# EAGLE design pixelAdapter_l432 pro (EAGLE 9.6.2)
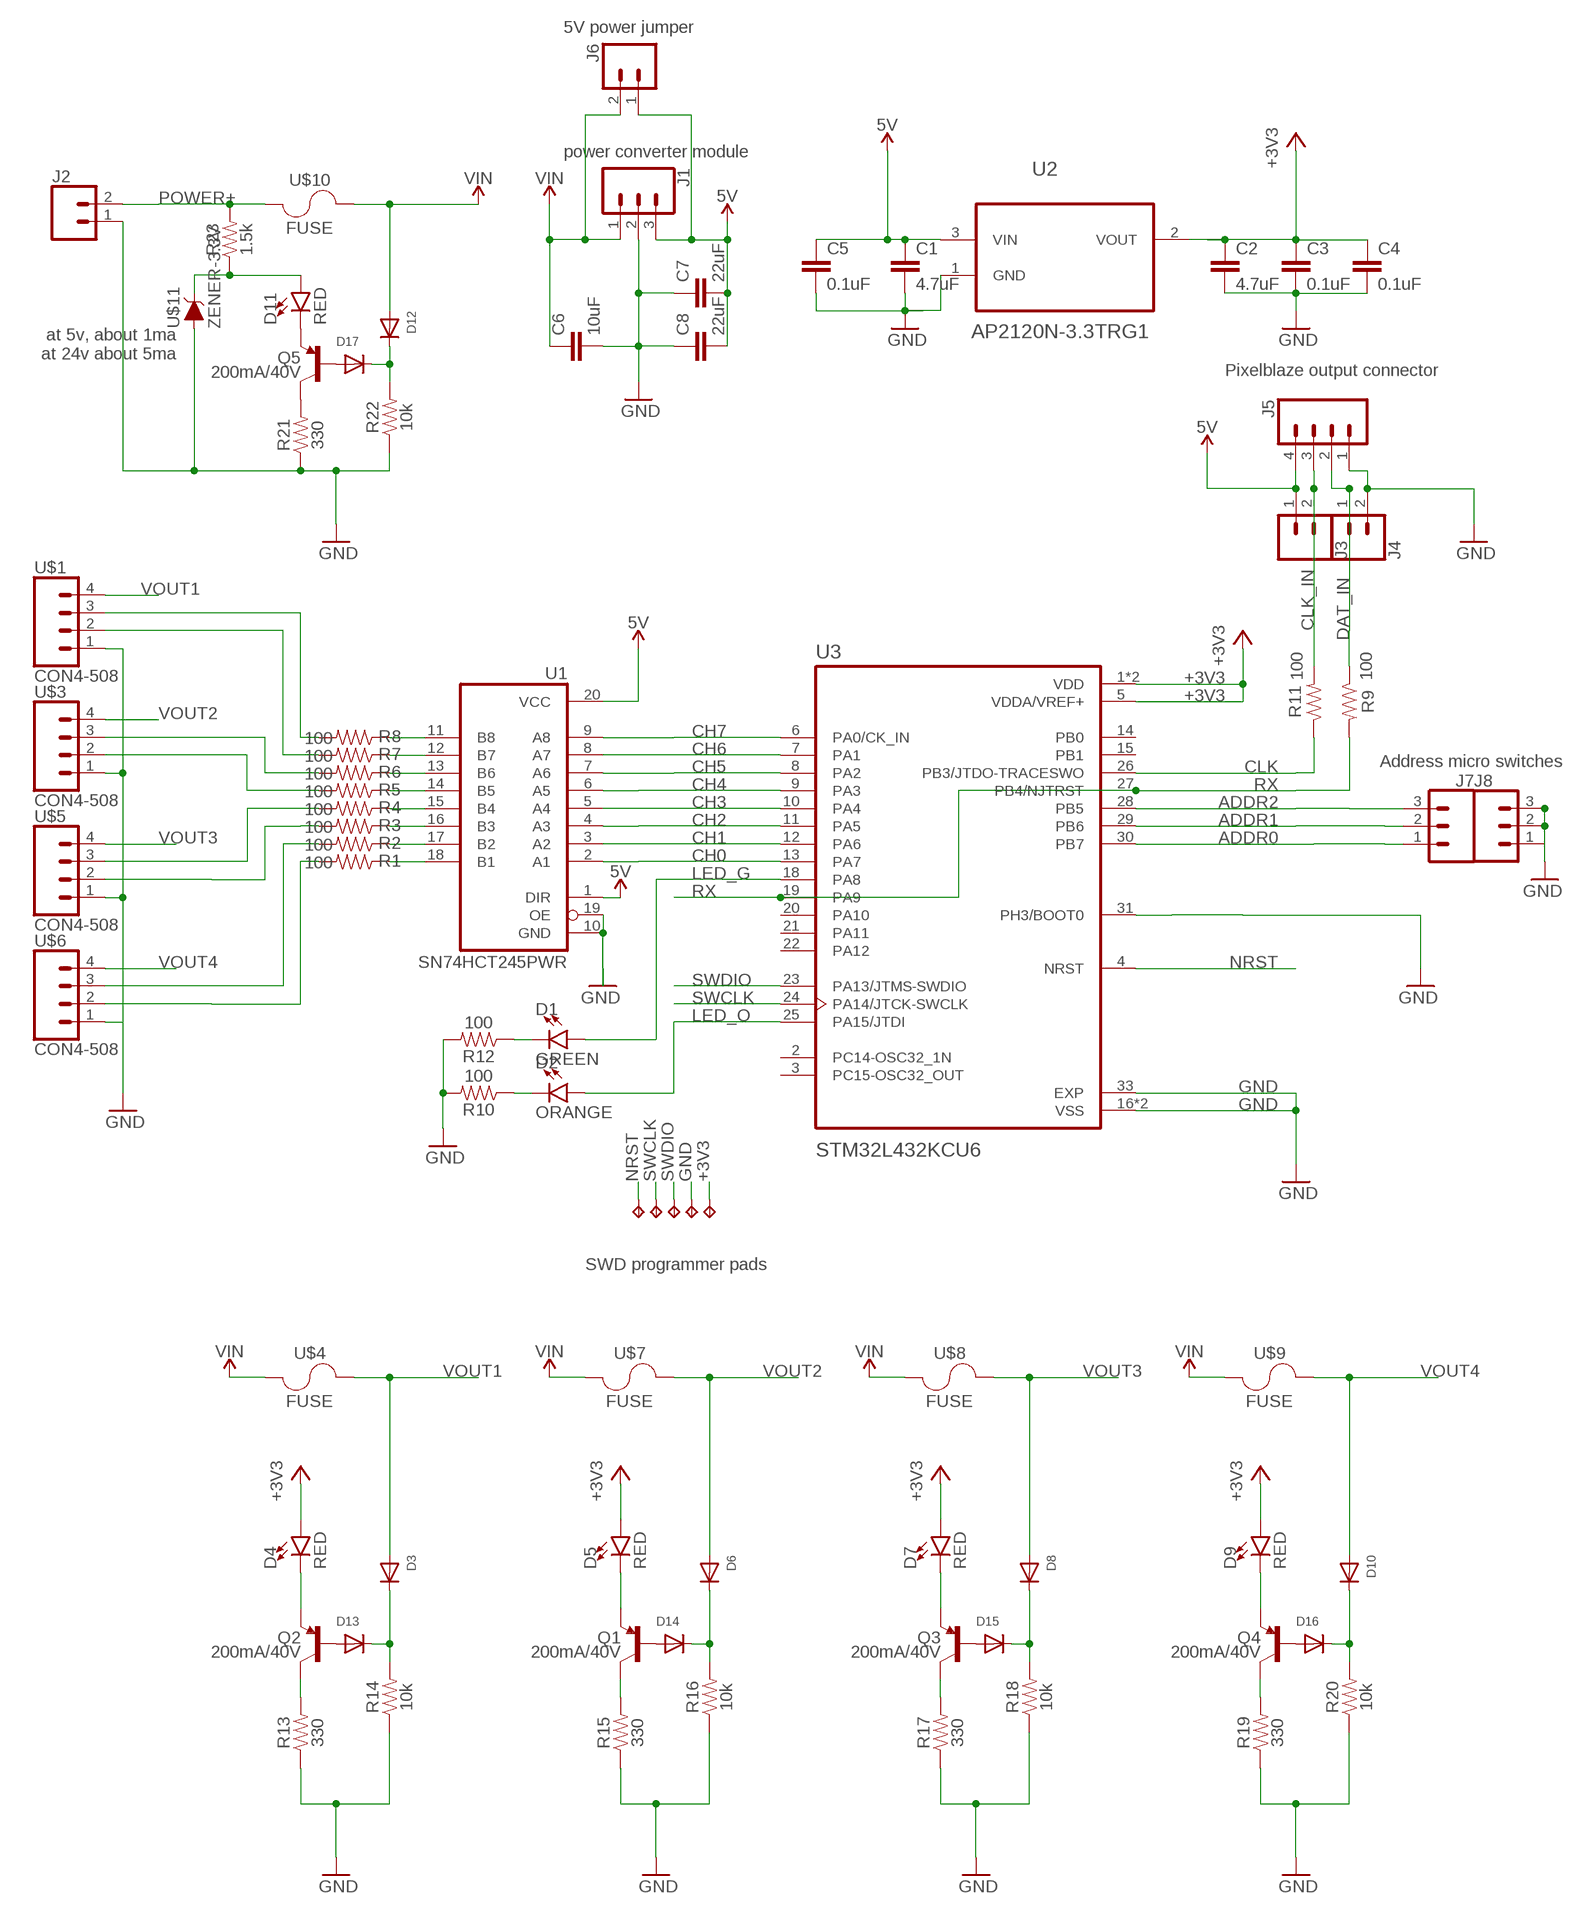
[diagram p0: schematic, sheet 1]

## Parts
C1  4.7uF  4.7UF0603  [0603]
C2  4.7uF  4.7UF0603  [0603]
C3  0.1uF  0.1UF-0603-25V-(+80/-20%)  [0603]
C4  0.1uF  0.1UF-0603-25V-(+80/-20%)  [0603]
C5  0.1uF  0.1UF-0603-25V-(+80/-20%)  [0603]
C6  10uF  10UF-1210-50V-20%  [1210]
C7  22uF  22UF-1210-16V-20%  [1210]
C8  22uF  22UF-1210-16V-20%  [1210]
D1  GREEN  LED0603  [LED-0603]
D2  ORANGE  LED0603  [LED-0603]
D3  DIODESOD-123  [SOD-123]
D4  RED  LED-RED0603  [LED-0603]
D5  RED  LED-RED0603  [LED-0603]
D6  DIODESOD-123  [SOD-123]
D7  RED  LED-RED0603  [LED-0603]
D8  DIODESOD-123  [SOD-123]
D9  RED  LED-RED0603  [LED-0603]
D10  DIODESOD-123  [SOD-123]
D11  RED  LED-RED0603  [LED-0603]
D12  DIODESOD-123  [SOD-123]
D13  DIODESOD-123  [SOD-123]
D14  DIODESOD-123  [SOD-123]
D15  DIODESOD-123  [SOD-123]
D16  DIODESOD-123  [SOD-123]
D17  DIODESOD-123  [SOD-123]
J1  CONN_03  [1X03]
J2  CONN_025MM  [SCREWTERMINAL-5MM-2]
J3  CONN_025MM  [SCREWTERMINAL-5MM-2]
J4  CONN_025MM  [SCREWTERMINAL-5MM-2]
J5  CONN_04LOCK  [1X04_LOCK]
J6  CONN_02  [1X02]
J7  CONN_03LOCK  [1X03_LOCK]
J8  CONN_03LOCK  [1X03_LOCK]
Q1  200mA/40V  TRANS_PNP-PMBT3906|MMBT3906L  [SOT23-3]
Q2  200mA/40V  TRANS_PNP-PMBT3906|MMBT3906L  [SOT23-3]
Q3  200mA/40V  TRANS_PNP-PMBT3906|MMBT3906L  [SOT23-3]
Q4  200mA/40V  TRANS_PNP-PMBT3906|MMBT3906L  [SOT23-3]
Q5  200mA/40V  TRANS_PNP-PMBT3906|MMBT3906L  [SOT23-3]
R1  100  100OHM-0603-1/10W-1%  [0603]
R2  100  100OHM-0603-1/10W-1%  [0603]
R3  100  100OHM-0603-1/10W-1%  [0603]
R4  100  100OHM-0603-1/10W-1%  [0603]
R5  100  100OHM-0603-1/10W-1%  [0603]
R6  100  100OHM-0603-1/10W-1%  [0603]
R7  100  100OHM-0603-1/10W-1%  [0603]
R8  100  100OHM-0603-1/10W-1%  [0603]
R9  100  100OHM-0603-1/10W-1%  [0603]
R10  100  100OHM-0603-1/10W-1%  [0603]
R11  100  100OHM-0603-1/10W-1%  [0603]
R12  100  100OHM-0603-1/10W-1%  [0603]
R13  330  RESISTOR0603  [0603]
R14  10k  10KOHM-0603-1/10W-1%  [0603]
R15  330  RESISTOR0603  [0603]
R16  10k  10KOHM-0603-1/10W-1%  [0603]
R17  330  RESISTOR0603  [0603]
R18  10k  10KOHM-0603-1/10W-1%  [0603]
R19  330  RESISTOR0603  [0603]
R20  10k  10KOHM-0603-1/10W-1%  [0603]
R21  330  RESISTOR0603  [0603]
R22  10k  10KOHM-0603-1/10W-1%  [0603]
R23  1.5k  1.5KOHM-0603-1/10W-1%  [0603]
TP1  TPTP20SQ  [TP20SQ]
TP2  TPTP20SQ  [TP20SQ]
TP3  TPTP20SQ  [TP20SQ]
TP4  TPTP20SQ  [TP20SQ]
TP5  TPTP20SQ  [TP20SQ]
U1  SN74HCT245PWR  74245PW  [TSSOP20]
U2  AP2120N-3.3TRG1  MCP1700T-3302E/TT  [SOT95P237X112-3N]
U3  STM32L432KCU6  [QFN50P500X500X60-33N]
U$1  CON4-508  [CON4-508]
U$3  CON4-508  [CON4-508]
U$4  FUSE  [KEYSTONE-3586-FUSEHOLDER]
U$5  CON4-508  [CON4-508]
U$6  CON4-508  [CON4-508]
U$7  FUSE  [KEYSTONE-3586-FUSEHOLDER]
U$8  FUSE  [KEYSTONE-3586-FUSEHOLDER]
U$9  FUSE  [KEYSTONE-3586-FUSEHOLDER]
U$10  FUSE  [KEYSTONE-3586-FUSEHOLDER]
U$11  ZENER-3.3V  ZENER  [SOD-123FL]

## Nets
5V: C1.1 C5.1 C7.2 C8.2 J1.3 J3.1 J5.4 J6.1 U1.1(DIR) U1.20(VCC) U2.3(VIN)
+3V3: C2.1 C3.1 C4.1 D4.A D5.A D7.A D9.A TP4.TP U2.2(VOUT) U3.1(VDD) U3.5(VDDA/VREF+) U3.17(VDD)
ADDR0: J7.1 U3.30(PB7)
ADDR1: J7.2 U3.29(PB6)
ADDR2: J7.3 U3.28(PB5)
CH0: U1.2(A1) U3.13(PA7)
CH1: U1.3(A2) U3.12(PA6)
CH2: U1.4(A3) U3.11(PA5)
CH3: U1.5(A4) U3.10(PA4)
CH4: U1.6(A5) U3.9(PA3)
CH5: U1.7(A6) U3.8(PA2)
CH6: U1.8(A7) U3.7(PA1)
CH7: U1.9(A8) U3.6(PA0/CK_IN)
CLK: R11.1 U3.26(PB3/JTDO-TRACESWO)
CLK_IN: J3.2 J5.3 R11.2
DAT_IN: J4.1 J5.2 R9.1
GND: C1.2 C2.2 C3.2 C4.2 C5.2 C6.2 C7.1 C8.1 J1.2 J2.1 J4.2 J5.1 J8.1 J8.2 J8.3 R10.2 R12.2 R13.1 R14.1 R15.1 R16.1 R17.1 R18.1 R19.1 R20.1 R21.1 R22.1 TP3.TP U1.10(GND) U1.19(OE) U2.1(GND) U3.16(VSS) U3.31(PH3/BOOT0) U3.32(VSS) U3.33(EXP) U$1.1 U$3.1 U$5.1 U$6.1 U$11.A
LED0: R1.2 U$6.2
LED1: R2.2 U$6.3
LED2: R3.2 U$5.2
LED3: R4.2 U$5.3
LED4: R5.2 U$3.2
LED5: R6.2 U$3.3
LED6: R7.2 U$1.2
LED7: R8.2 U$1.3
LED_G: D1.A U3.18(PA8)
LED_O: D2.A U3.25(PA15/JTDI)
N$1: D17.A Q5.1(B)
N$2: D1.C R12.1
N$3: D12.C D17.C R22.2
N$4: D3.C D13.C R14.2
N$5: D4.C Q2.2(E)
N$6: D11.C Q5.2(E)
N$7: Q2.3(C) R13.2
N$8: Q5.3(C) R21.2
N$9: D6.C D14.C R16.2
N$10: D5.C Q1.2(E)
N$11: Q1.3(C) R15.2
N$12: R1.1 U1.18(B1)
N$13: R2.1 U1.17(B2)
N$14: R3.1 U1.16(B3)
N$15: R4.1 U1.15(B4)
N$16: R5.1 U1.14(B5)
N$17: R6.1 U1.13(B6)
N$18: R7.1 U1.12(B7)
N$19: R8.1 U1.11(B8)
N$20: D11.A R23.1 U$11.C
N$21: D2.C R10.1
N$22: D8.C D15.C R18.2
N$23: D7.C Q3.2(E)
N$24: Q3.3(C) R17.2
N$25: D13.A Q2.1(B)
N$26: D10.C D16.C R20.2
N$27: D9.C Q4.2(E)
N$28: Q4.3(C) R19.2
N$29: D14.A Q1.1(B)
N$30: D15.A Q3.1(B)
N$31: D16.A Q4.1(B)
NRST: TP5.TP U3.4(NRST)
POWER+: J2.2 R23.2 U$10.A1 U$10.A2 U$10.A3
RX: R9.2 U3.19(PA9) U3.27(PB4/NJTRST)
SWCLK: TP1.TP U3.24(PA14/JTCK-SWCLK)
SWDIO: TP2.TP U3.23(PA13/JTMS-SWDIO)
VIN: C6.1 D12.A J1.1 J6.2 U$4.A1 U$4.A2 U$4.A3 U$7.A1 U$7.A2 U$7.A3 U$8.A1 U$8.A2 U$8.A3 U$9.A1 U$9.A2 U$9.A3 U$10.B1 U$10.B2 U$10.B3
VOUT1: D3.A U$1.4 U$4.B1 U$4.B2 U$4.B3
VOUT2: D6.A U$3.4 U$7.B1 U$7.B2 U$7.B3
VOUT3: D8.A U$5.4 U$8.B1 U$8.B2 U$8.B3
VOUT4: D10.A U$6.4 U$9.B1 U$9.B2 U$9.B3
Unconnected: U3.2(PC14-OSC32_1N) U3.3(PC15-OSC32_OUT) U3.14(PB0) U3.15(PB1) U3.20(PA10) U3.21(PA11) U3.22(PA12)

## Notes on the sheet
- 5V power jumper
- power converter module
- at 5v, about 1ma
  at 24v about 5ma
- Pixelblaze output connector
- Address micro switches
- SWD programmer pads

## Library data of the parts
C1 C2 = SparkFun-Capacitors:4.7UF: 4.7µF ceramic capacitors A capacitor is a passive two-terminal electrical component used to store electrical energy temporarily in an electric field.; PROD_ID: CAP-08280
C3-C5 = SparkFun-Capacitors:0.1UF: 0.1µF ceramic capacitors A capacitor is a passive two-terminal electrical component used to store electrical energy temporarily in an electric field.; PROD_ID: CAP-00810
C6 = SparkFun-Capacitors:10UF: 10.0µF ceramic capacitors A capacitor is a passive two-terminal electrical component used to store electrical energy temporarily in an electric field.; PROD_ID: CAP-09824
C7 C8 = SparkFun-Capacitors:22UF: 22µF ceramic capacitors A capacitor is a passive two-terminal electrical component used to store electrical energy temporarily in an electric field.
D1 D2 = SparkFun-LED:LED: LED (Generic) Standard schematic elements and footprints for 5mm, 3mm, 1206, and 0603 sized LEDs. Generic LEDs with no color specified.
D3 D6 D8 D10 D12-D17 = adafruit:DIODE: Diode SMADIODE - SMA Surface Mount Package 20V 1A Schottky Diode Digikey: 641-1014-6-ND DO-1N4148 - Through Hole Small Current Diode SOD-123 20V 1 A (.5mV Vf) Schottky Diode - Digikey: MBRX120TPMSCT-ND SOD-323 10V 570mA (.38mV Vf, 3ns) Schottky Diode - Digikey: ZLLS410CT-ND SOD-523 30V 30mA Schottky Diode (RB751S-40TE61) - Digikey: RB751S-40TE61CT-ND SOT23-R/W - SOT23 Package (R = Solder Paste/Reflow Ovens, W = Hand-Soldering) BAT54Film 40V 300mA - Digikey: 497-7162-1-ND
D4 D5 D7 D9 D11 = SparkFun-LED:LED-RED: Red SMD LED Used in manufacturing of most products at SparkFun Packages: 0603 - SMD 0603 package [Product Link] <http://docs.avagotech.com/docs/AV02-0551EN> 0603 SMART - SMD 0603 SMART package ( more efficient and expensive)[Product Link] <http://www.osram-os.com/Graphics/XPic2/00077099_0.pdf> 1206 - SMD1206 package [Product Link] <https://www.sparkfun.com/datasheets/DevTools/LilyPad/Q150OVS4.pdff> SparkFun Products: Pro Mini 328 -5V <https://www.sparkfun.com/products/821> RedBoard <https://www.sparkfun.com/products/12757> IOIO-OTG <https://www.sparkfun.com/products/13613>; PROD_ID: DIO-00819
J1 J7 J8 = SparkFun-Connectors:CONN_03: Multi connection point. Often used as Generic Header-pin footprint for 0.1 inch spaced/style header connections On any of the 0.1 inch spaced packages, you can populate with these: Break Away Headers - Straight <https://www.sparkfun.com/products/116> (PRT-00116) Break Away Male Headers - Right Angle <https://www.sparkfun.com/products/553> (PRT-00553) Female Headers <https://www.sparkfun.com/products/115> (PRT-00115) Break Away Headers - Machine Pin <https://www.sparkfun.com/products/117> (PRT-00117) Break Away Female Headers - Swiss Machine Pin <https://www.sparkfun.com/products/743> (PRT-00743) Stackable Header - 3 Pin (Female, 0.1") <https://www.sparkfun.com/products/13875> (PRT-13875) For SCREWTERMINALS and SPRING TERMINALS visit here: Screw Terimnals on SparkFun.com <https://www.sparkfun.com/search/results?term=Screw+Terminals> (5mm/3.5mm/2.54mm spacing) This device is also useful as a general connection point to wire up your design to another part of your project. Our various solder wires solder well into these plated through hole pads. Hook-Up Wire - Assortment (Stranded, 22 AWG) <https://www.sparkfun.com/products/11375> (PRT-11375) Hook-Up Wire - Assortment (Solid Core, 22 AWG) <https://www.sparkfun.com/products/11367> (PRT-11367) View the entire wire category on our website here <https://www.sparkfun.com/categories/141> Special notes: Molex polarized connector foot print use with SKU : PRT-08232 with associated crimp pins and housings.
J2-J4 = bens:CONN_02: Multi connection point. Often used as Generic Header-pin footprint for 0.1 inch spaced/style header connections On any of the 0.1 inch spaced packages, you can populate with these: Break Away Headers - Straight <https://www.sparkfun.com/products/116> (PRT-00116) Break Away Male Headers - Right Angle <https://www.sparkfun.com/products/553> (PRT-00553) Female Headers <https://www.sparkfun.com/products/115> (PRT-00115) Break Away Headers - Machine Pin <https://www.sparkfun.com/products/117> (PRT-00117) Break Away Female Headers - Swiss Machine Pin <https://www.sparkfun.com/products/743> (PRT-00743) For SCREWTERMINALS and SPRING TERMINALS visit here: Screw Terimnals on SparkFun.com <https://www.sparkfun.com/search/results?term=Screw+Terminals> (5mm/3.5mm/2.54mm spacing) This device is also useful as a general connection point to wire up your design to another part of your project. Our various solder wires solder well into these plated through hole pads. Hook-Up Wire - Assortment (Stranded, 22 AWG) <https://www.sparkfun.com/products/11375> (PRT-11375) Hook-Up Wire - Assortment (Solid Core, 22 AWG) <https://www.sparkfun.com/products/11367> (PRT-11367) View the entire wire category on our website here <https://www.sparkfun.com/categories/141> Special notes: Molex polarized connector foot print use with: PRT-08233 with associated crimp pins and housings. 2.54_SCREWTERM for use with PRT-10571. 3.5mm Screw Terminal footprints for PRT-08084 5mm Screw Terminal footprints for use with PRT-08432; SF_SKU: PRT-08432
J5 = SparkFun-Connectors:CONN_04: Multi connection point. Often used as Generic Header-pin footprint for 0.1 inch spaced/style header connections On any of the 0.1 inch spaced packages, you can populate with these: Break Away Headers - Straight <https://www.sparkfun.com/products/116> (PRT-00116) Break Away Male Headers - Right Angle <https://www.sparkfun.com/products/553> (PRT-00553) Female Headers <https://www.sparkfun.com/products/115> (PRT-00115) Break Away Headers - Machine Pin <https://www.sparkfun.com/products/117> (PRT-00117) Break Away Female Headers - Swiss Machine Pin <https://www.sparkfun.com/products/743> (PRT-00743) For SCREWTERMINALS and SPRING TERMINALS visit here: Screw Terimnals on SparkFun.com <https://www.sparkfun.com/search/results?term=Screw+Terminals> (5mm/3.5mm/2.54mm spacing) This device is also useful as a general connection point to wire up your design to another part of your project. Our various solder wires solder well into these plated through hole pads. Hook-Up Wire - Assortment (Stranded, 22 AWG) <https://www.sparkfun.com/products/11375> (PRT-11375) Hook-Up Wire - Assortment (Solid Core, 22 AWG) <https://www.sparkfun.com/products/11367> (PRT-11367) View the entire wire category on our website here <https://www.sparkfun.com/categories/141> Special notes: Molex polarized connector foot print use with SKU : PRT-08231 with associated crimp pins and housings. 1MM SMD Version SKU: PRT-10208; PROD_ID: CONN-09696
J6 = SparkFun-Connectors:CONN_02: Multi connection point. Often used as Generic Header-pin footprint for 0.1 inch spaced/style header connections On any of the 0.1 inch spaced packages, you can populate with these: Break Away Headers - Straight <https://www.sparkfun.com/products/116> (PRT-00116) Break Away Male Headers - Right Angle <https://www.sparkfun.com/products/553> (PRT-00553) Female Headers <https://www.sparkfun.com/products/115> (PRT-00115) Break Away Headers - Machine Pin <https://www.sparkfun.com/products/117> (PRT-00117) Break Away Female Headers - Swiss Machine Pin <https://www.sparkfun.com/products/743> (PRT-00743) For SCREWTERMINALS and SPRING TERMINALS visit here: Screw Terimnals on SparkFun.com <https://www.sparkfun.com/search/results?term=Screw+Terminals> (5mm/3.5mm/2.54mm spacing) This device is also useful as a general connection point to wire up your design to another part of your project. Our various solder wires solder well into these plated through hole pads. Hook-Up Wire - Assortment (Stranded, 22 AWG) <https://www.sparkfun.com/products/11375> (PRT-11375) Hook-Up Wire - Assortment (Solid Core, 22 AWG) <https://www.sparkfun.com/products/11367> (PRT-11367) View the entire wire category on our website here <https://www.sparkfun.com/categories/141> Special notes: Molex polarized connector foot print use with: PRT-08233 with associated crimp pins and housings. 2.54_SCREWTERM for use with PRT-10571. 3.5mm Screw Terminal footprints for PRT-08084 5mm Screw Terminal footprints for use with PRT-08432
Q1-Q5 = SparkFun-DiscreteSemi:TRANS_PNP: PNP transistor Current controlled devices typically used to amplify current or used as a switch. SparkFun Products: SparkFun Serial Enabled 16x2 LCD - Red on Black <https://www.sparkfun.com/products/9068> SparkFun Logomatic <https://www.sparkfun.com/products/12772>; PROD_ID: TRANS-08052
R1-R12 = SparkFun-Resistors:100OHM: 100Ω resistor A resistor is a passive two-terminal electrical component that implements electrical resistance as a circuit element. Resistors act to reduce current flow, and, at the same time, act to lower voltage levels within circuits. - Wikipedia; PROD_ID: RES-07863
R13 R15 R17 R19 R21 = SparkFun-Resistors:RESISTOR: Generic Resistor Package
R14 R16 R18 R20 R22 = SparkFun-Resistors:10KOHM: 10kΩ resistor A resistor is a passive two-terminal electrical component that implements electrical resistance as a circuit element. Resistors act to reduce current flow, and, at the same time, act to lower voltage levels within circuits. - Wikipedia; PROD_ID: RES-00824
R23 = SparkFun-Resistors:1.5KOHM: 1.5kΩ resistor A resistor is a passive two-terminal electrical component that implements electrical resistance as a circuit element. Resistors act to reduce current flow, and, at the same time, act to lower voltage levels within circuits. - Wikipedia; PROD_ID: RES-08306
TP1-TP5 = testpad:TP: Test pad
U1 = scanlime:74*245: Octal BUS TRANSCEIVER, 3-state
U2 = Microchip_By_element14_Batch_1:MCP1700T-3302E/TT: Low Quiescent Current LDO; MPN: MCP1700T-3302E/TT; OC_FARNELL: 1296592; OC_NEWARK: 88H9817; PACKAGE: SOT23-3; SUPPLIER: Microchip
U3 = STM32L432KCU6:STM32L432KCU6: None Check prices <https://pricing.snapeda.com/parts/STM32L432KCU6/STMicroelectronics/view-part?ref=eda>; AVAILABILITY: Good; DESCRIPTION: ARM® Cortex®-M4 STM32L4 Microcontroller IC 32-Bit 80MHz 256KB (256K x 8) FLASH 32-UFQFPN (5x5); MF: STMicroelectronics; MP: STM32L432KCU6; PACKAGE: UFQFN-32 STMicroelectronics; PRICE: None; PURCHASE-URL: https://pricing.snapeda.com/search/part/STM32L432KCU6/?ref=eda
U$1 U$3 U$5 U$6 = bens:CON4-508
U$4 U$7-U$10 = bens:FUSE
U$11 = bens:ZENER

## Net classes
1 power: width 0.254 mm

## Board
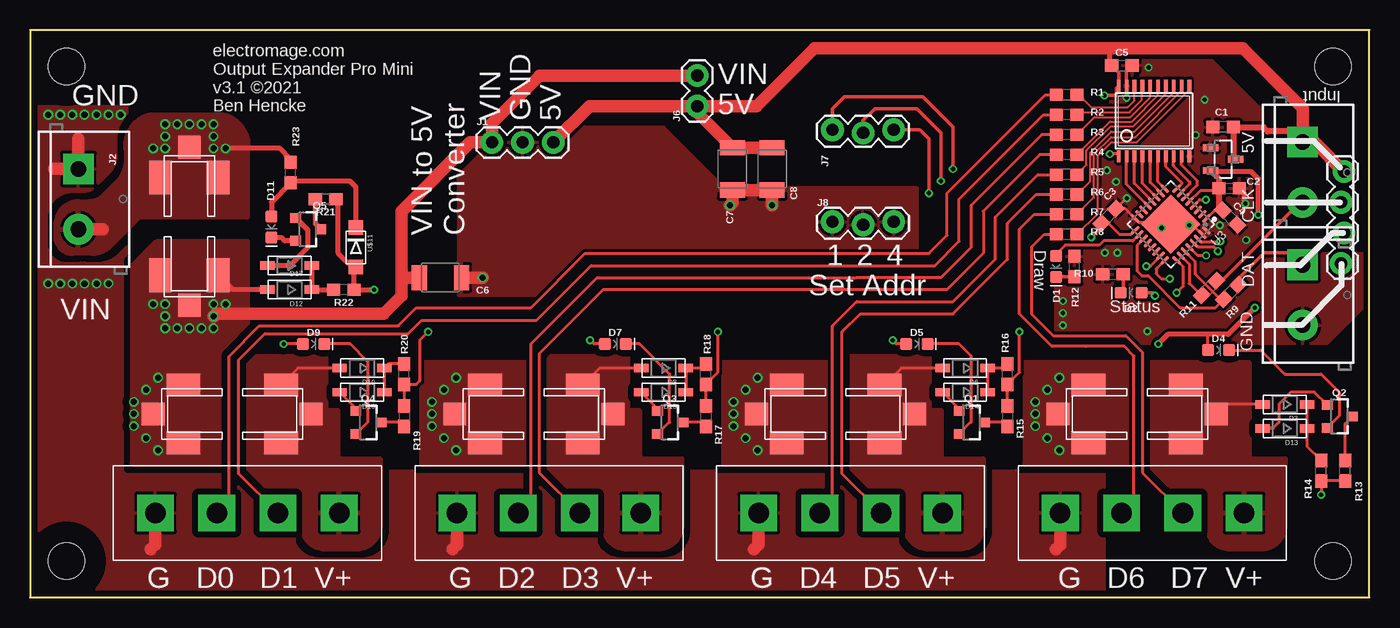
[diagram p1: board, top side]
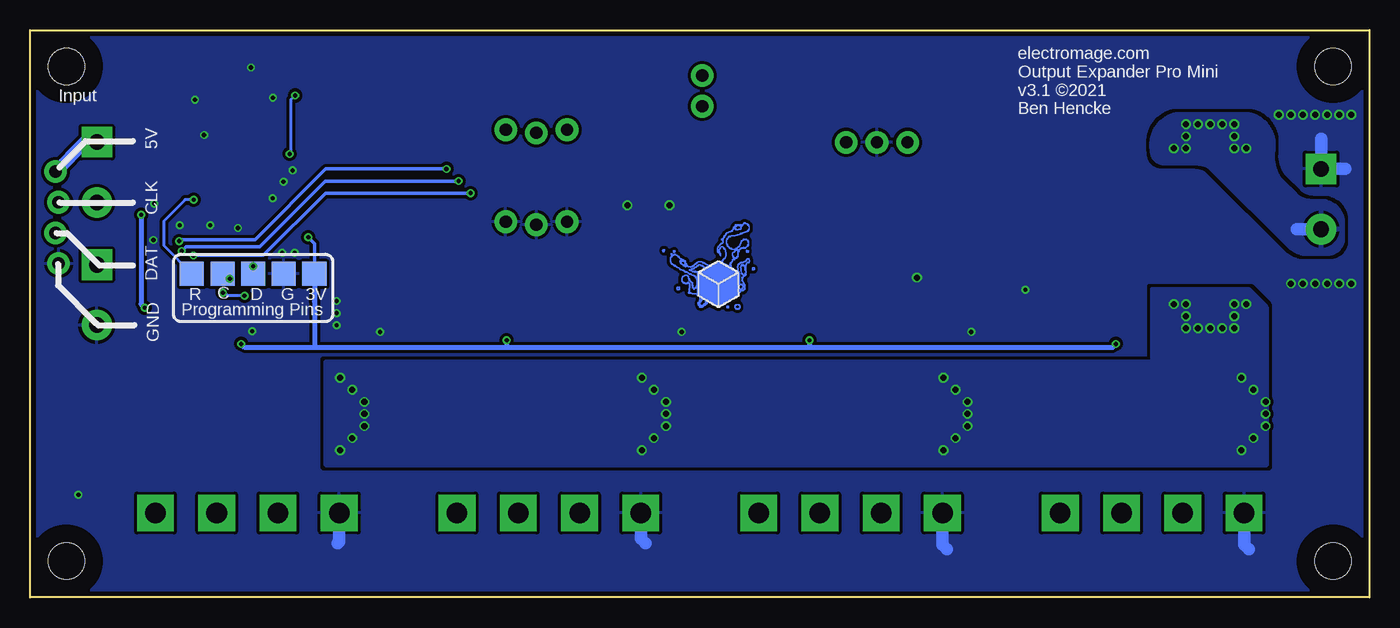
[diagram p2: board, bottom side, seen from below]

Size 111 x 47 mm. Coordinates in mm from the lower left corner, seen from the top.
Outline: 0,0 111,0 111,47 0,47 0,0
Copper layers (1*16): Top 0.035mm / dielectric 1.5mm / Bottom 0.035mm
Design rules "jlcpcb_2_layer *": minimum track width 6mil, minimum drill 0.35mm, track to track 6mil, track to pad 6mil, pad to pad 6mil, via to via 6mil, smd to smd 6mil, copper to edge 0.4mm, drill to drill 6mil, minimum pad ring 6mil, minimum via ring 6mil, stop-mask expansion 1mil, vias tented up to drill 25mil, thermal gap 10mil
Holes 3 mm at 3,3 108,3 3,44 108,44
tRestrict: area 0.3,0.3 to 5.7,5.7; area 0.3,41.3 to 5.7,46.7
bRestrict: area 0.3,0.3 to 5.7,5.7; area 0.3,41.3 to 5.7,46.7; area 105.3,41.3 to 110.7,46.7; area 105.3,0.3 to 110.7,5.7

### Footprints (pad centres in the part's own frame; a part is rotated, then mirrored left to right if it is on the bottom)
0603 = smd 1.1 x 1: 1 -0.85,0; 2 0.85,0
1210 = smd 1.27 x 2.06: 1 -1.755,0; 2 1.755,0
LED-0603 = smd 1 x 1: A -0.877,0; C 0.877,0
SOD-123 = smd 1.2 x 0.7: A 1.85,0; C -1.85,0
1X03 = drill 1.016 pad 1.88: 1 0,0; 2 2.54,0; 3 5.08,0
SCREWTERMINAL-5MM-2 = drill 1.3 pad 2.54 square: 1 0,0 | drill 1.3 pad 2.54: 2 5,0
1X04_LOCK = drill 1.016 pad 1.88: 1 0,0.127; 2 2.54,-0.127; 3 5.08,0.127; 4 7.62,-0.127
1X02 = drill 1.016 pad 1.88: 1 0,0; 2 2.54,0
1X03_LOCK = drill 1.016 pad 1.88: 1 0,0.127; 2 2.54,-0.127; 3 5.08,0.127
SOT23-3 = smd 0.8 x 0.9: 1 -0.95,-1; 2 0.95,-1; 3 0,1.1
TP20SQ = smd 2 x 2: TP 0,0
TSSOP20 = smd 0.305 x 0.991: 1 -2.925,-2.918; 2 -2.275,-2.918; 3 -1.625,-2.918; 4 -0.975,-2.918; 5 -0.325,-2.918; 6 0.325,-2.918; 7 0.975,-2.918; 8 1.625,-2.918; 9 2.275,-2.918; 10 2.925,-2.918; 11 2.925,2.918; 12 2.275,2.918; 13 1.625,2.918; 14 0.975,2.918; 15 0.325,2.918; 16 -0.325,2.918; 17 -0.975,2.918; 18 -1.625,2.918; 19 -2.275,2.918; 20 -2.925,2.918
SOT95P237X112-3N = smd 0.559 x 1.27: 1 -0.94,-1.041; 2 0.94,-1.041; 3 0,1.041
QFN50P500X500X60-33N = smd 0.86 x 0.25: 1 -2.435,1.75; 2 -2.435,1.25; 3 -2.435,0.75; 4 -2.435,0.25; 5 -2.435,-0.25; 6 -2.435,-0.75; 7 -2.435,-1.25; 8 -2.435,-1.75; 17 2.435,-1.75; 18 2.435,-1.25; 19 2.435,-0.75; 20 2.435,-0.25; 21 2.435,0.25; 22 2.435,0.75; 23 2.435,1.25; 24 2.435,1.75 | smd 0.25 x 0.86: 9 -1.75,-2.435; 10 -1.25,-2.435; 11 -0.75,-2.435; 12 -0.25,-2.435; 13 0.25,-2.435; 14 0.75,-2.435; 15 1.25,-2.435; 16 1.75,-2.435; 25 1.75,2.435; 26 1.25,2.435; 27 0.75,2.435; 28 0.25,2.435; 29 -0.25,2.435; 30 -0.75,2.435; 31 -1.25,2.435; 32 -1.75,2.435 | smd 3.45 x 3.45: 33 0,0
CON4-508 = drill 1.7 pad 3.048 square: 1 -7.62,0; 2 -2.54,0; 3 2.54,0; 4 7.62,0
KEYSTONE-3586-FUSEHOLDER = smd 2.8 x 1.9: A1 -3.8,2.6; A3 -3.8,-2.2; B1 4.3,2.6; B3 4.3,-2.2 | smd 1.9 x 1.9: A2 -6.3,0.2; B2 6.8,0.2
SOD-123FL = smd 1.2 x 1.2: A 1.637,0; C -1.637,0

### Placement (x,y rotation side)
C1  98.88,38.98 180 top
C2  99.38,33.9 0 top
C3  89.39,31.61 45 top
C4  99.45,31.48 315 top
C5  90.49,44.08 0 top
C6  34,26.5 0 top
C7  58.2,35.5 90 top
C8  61.5,35.5 90 top
D1  85.03,27.42 270 top
D2  91.25,25.24 180 top
D3  104,16 180 top
D4  98.5,20.5 0 top
D5  73.5,21 0 top
D6  77.5,19 180 top
D7  48.5,21 0 top
D8  52.5,19 180 top
D9  23.5,21 0 top
D10  27.5,19 180 top
D11  20,30.7 270 top
D12  21.5,25.5 180 top
D13  104,14 180 top
D14  77.5,17 180 top
D15  52.5,17 180 top
D16  27.5,17 180 top
D17  21.5,27.5 180 top
J1  38.28,37.7 0 top
J2  4,35.5 270 top
J3  105.47,37.72 270 top
J4  105.47,27.56 270 top
J5  108.77,27.66 90 top
J6  55.3,40.7 90 top
J7  66.5,38.62 0 top
J8  66.5,31 0 top
Q1  78,14.5 270 top
Q2  108.5,15 270 top
Q3  53,14.5 270 top
Q4  28,14.5 270 top
Q5  23,30.5 270 top
R1  85.91,41.64 180 top
R2  85.91,39.99 180 top
R3  85.91,38.34 180 top
R4  85.91,36.69 180 top
R5  85.91,35.04 180 top
R6  85.91,33.39 180 top
R7  85.91,31.74 180 top
R8  85.91,30.09 180 top
R9  99.53,25.31 225 top
R10  89.75,26.77 180 top
R11  97.72,25.64 45 top
R12  86.55,27.42 90 top
R13  109,10.5 90 top
R14  107,10.5 90 top
R15  81,15 270 top
R16  81,18.5 90 top
R17  56,15 270 top
R18  56,18.5 90 top
R19  31,15 270 top
R20  31,18.5 90 top
R21  24.5,33 180 top
R22  26,25.5 180 top
R23  21.6,35.2 90 top
TP1  95.06,26.81 90 bottom
TP2  92.52,26.81 90 bottom
TP3  89.98,26.81 90 bottom
TP4  87.44,26.81 90 bottom
TP5  97.6,26.81 270 bottom
U1  93.15,39.48 0 top
U2  98.88,36.31 270 top
U3  94.54,30.91 225 top
U$1  93,7 0 top
U$2  [ELECTRO_MAGE_PCB4_PIXEL_2#PNG]  54.77,27.5 0 bottom
U$3  68,7 0 top
U$4  91.5,15 0 top
U$5  43,7 0 top
U$6  18,7 0 top
U$7  66.5,15 0 top
U$8  41.5,15 0 top
U$9  16.5,15 0 top
U$10  13,31 270 top
U$11  27,29 270 top

### Tracks (layer width: path | path; a pad name or v marks a point on that pad's centre or on a via)
5V  (via drill 0.35)
  Top 0.254: U1.1 90.23,36.74 v89.5,36.74
  Top 0.305: v89.05,41.59 v89.06,41.6 90.03,41.6 90.03,42.2 U1.20 90.23,43.48 C5.1
  Top 0.406: C5.1 89.5,44.21 89.5,45.5
  Top 0.508: U2.3 99.73,36.5 C1.1 102.23,38.98 102.58,38.62 104.57,38.62 J3.1
  Top 1.016: J6.1 46.35,40.7 J1.3 | J6.1 60.2,40.7 65,45.5 89.5,45.5 100.5,45.5 105.47,40.53 J3.1 106.46,37.72 J5.4 | C7.2 58.16,37.3 | C7.2 C8.2 | C7.2 55.3,40.16 J6.1
  Bottom 0.254: v89.05,41.59 89.4,41.24 89.4,36.84 v89.5,36.74
  Bottom 1.016: J5.4 106.46,37.72 J3.1
+3V3  (via drill 0.35)
  Top 0.254: U3.5 96.97,33.69 98.32,33.69 C2.1 | U3.17 91.27,30.11 90.28,30.11 89.38,31.01 C3.1 | U3.1 98.19,32.08 C4.1 | D9.A v21,21 | D4.A 97.62,21.8 94.3,21.8 | D7.A 46.7,21 v46.4,21.3 | D5.A 71.8,21 v71.5,21.3
  Top 0.305: C3.1 88.79,30.68 v87.95,29.83
  Top 0.406: U2.2 97.94,35.27 101.23,35.27 101.8,34.7 v101.8,31.7 | v101.5,24 99.3,21.8 94.3,21.8 v93.5,21
  Top 0.508: U2.2 98.53,34.68 C2.1 98.57,33.85 98.57,32.36 C4.1
  Bottom 0.305: TP4.TP 87.44,29.32 v87.95,29.83
  Bottom 0.406: TP4.TP 87.44,24.5 87.44,20.7 | 46.4,20.7 21.3,20.7 v21,21 | 46.4,20.7 46.5,20.7 71,20.7 71.5,20.7 | 71.5,20.7 87.44,20.7 | 87.44,20.7 93.2,20.7 v93.5,21 | v46.4,21.3 46.4,20.7 | v71.5,21.3 71.5,20.7 | v101.5,24 101.8,24.3 v101.8,31.7
ADDR0  (via drill 0.35)
  Top 0.254: U3.30 97.09,29.42 98.54,29.42 v98.64,29.52
  Top 0.305: v76.5,35.5 76.5,39 74,41.5 67.5,41.5 66.5,40.5 J7.1
  Bottom 0.305: v98.64,29.52 98.51,29.65 92.35,29.65 86.5,35.5 v76.5,35.5
ADDR1  (via drill 0.35)
  Top 0.254: U3.29 96.78,29.02 98.11,29.02 v98.43,28.69
  Top 0.305: v75.5,34.5 75.5,38.5 73.5,40.5 70,40.5 69.04,39.54 J7.2
  Bottom 0.305: v98.43,28.69 98.06,29.07 91.97,29.07 86.54,34.5 v75.5,34.5
ADDR2  (via drill 0.35)
  Top 0.254: U3.28 96.76,28.33 v97.47,28.33
  Top 0.305: v74.5,33.5 74.5,38 73.75,38.75 J7.3
  Bottom 0.305: v97.47,28.33 91.67,28.33 86.51,33.5 v74.5,33.5
CH0
  Top 0.254: U1.2 90.88,34.22 U3.13
CH1
  Top 0.254: U3.12 91.5,34.3 91.5,36.54 U1.3
CH2
  Top 0.254: U3.11 92.19,34.32 92.19,36.55 U1.4
CH3
  Top 0.254: U3.10 92.83,34.39 U1.5
CH4
  Top 0.254: U3.9 93.48,34.44 U1.6
CH5
  Top 0.254: U3.8 95.49,34.33 94.13,35.69 U1.7
CH6
  Top 0.254: U3.7 96.12,34.26 96.12,34.42 94.77,35.77 U1.8
CH7
  Top 0.254: U3.6 96.76,34.19 96.76,34.51 95.41,35.86 95.41,36.55 U1.9
CLK
  Top 0.254: U3.26 96.07,27.61 96.07,26.02 97.06,25.04 R11.1
CLK_IN
  Top 0.305: J5.3 105.49,32.74 J3.2 105.27,32.72 98.79,26.24 R11.2
DAT_IN
  Top 0.305: J5.2 108.11,30.2 J4.1 104.47,28.56 102.28,28.56 100.13,26.41 R9.1
GND  (via drill 0.35, 0.5)
  Top 0.254: U1.19 v90.88,41.4 | U3.31 96.37,30.85 v96.07,30.85 | U3.33 94.35,31.1 91.87,31.1 U3.16 91.02,31.95 90.76,32.21 C3.2 90.87,33.08 v90.89,33.08 | R19.1 R20.1 32,17.65 32.3,17.95 32.3,21.3 v33,22 | R13.1 R14.1 v107,8.5 | R17.1 R18.1 57,18.65 v57,22 | R15.1 R16.1 82,18.65 v82,22
  Top 0.305: U1.19 90.88,43.62 C5.2
  Top 0.406: 26.85,27.21 R22.1 v28.5,25.5 | 26.85,27.21 U$11.A | R21.1 25.5,32.85 25.5,28.56 26.85,27.21 | C2.2 100.61,33.51 100.61,32.73 v100.71,32.63
  Top 1.016: v61.5,32.5 C8.1 C7.1 58.2,32.7 v58,32.5 | C6.2 v37.5,26.5 | 2,35.5 J2.1 4,38 | U$6.1 10.38,4.38 10,4 | U$5.1 35.38,4.38 35,4 | U$3.1 60.38,4.38 60,4 | U$1.1 85.38,4.38 85,4
  Bottom 1.016: 2,35.5 J2.1 4,38 | U$1.1 85.38,4.62 85.5,4.5 | U$3.1 60.38,4.88 60,4.5 | U$5.1 35.38,4.38 35,4 | U$6.1 10.38,4.38 10,4
  other vias: 97.34,41.23 92.7,43.9 93.78,30.61 90.11,28.56 96.59,38.32 89.24,35.38 98.61,30.85 90,34.43 89.09,28.56 1.5,40 2.5,40 3.5,40 4.5,40 5.5,40 6.5,40 7.5,40 85.59,22.56 92.59,22.06 85.59,23.56 85.59,24.56 100.79,29.62 1.5,26 2.5,26 3.5,26 4.5,26 5.5,26 6.5,26
  pour Bottom (isolate 0.254, rank 6): 0.5,46.5 110.5,46.5 110.5,0.5 0.5,0.5
  pour Top (isolate 0.508, rank 6): 89,10.5 89,0.5 0.5,0.5 0.5,40.7 8,40.7 8,10.5
  pour Top (isolate 0.254, rank 6): 110.5,28.5 110.5,24 107.5,21 85,21 85,38.5 91,44.5 98,44.5 102,40.5 102,28.5
  pour Top (isolate 0.254): 35.5,25 35.5,35 39.5,39 52.5,39 57.5,34 73.5,34 73.5,27 71.5,25
LED0
  Top 0.254: U$6.2 16.5,8.04 16.5,20 19,22.5 30.5,22.5 32,24 41.5,24 46,28.5 74.5,28.5 76,30 76,33.5 84.14,41.64 R1.2
LED1
  Top 0.254: U$6.3 17.3,10.24 17.3,19.7 19.46,21.86 31.34,21.86 32.45,22.96 41.96,22.96 46.5,27.5 75,27.5 77,29.5 77,33 83.99,39.99 R2.2
LED2
  Top 0.254: U$5.2 41.5,8.04 41.5,21 47,26.5 68.5,26.5 75.5,26.5 78,29 78,32.5 83.84,38.34 R3.2
LED3
  Top 0.254: R4.2 83.69,36.69 79,32 79,28.5 76,25.5 47.5,25.5 42.2,20.2 42.2,10.34 U$5.3
LED4
  Top 0.254: U$3.2 66.5,8.04 66.5,22.5 68.5,24.5 76.5,24.5 80,28 80,31.5 83.54,35.04 R5.2
LED5
  Top 0.254: U$3.3 67.3,10.24 67.3,22 68.8,23.5 76.5,23.5 81,28 81,31 83.39,33.39 R6.2
LED6
  Top 0.254: R7.2 83.24,31.74 82,30.5 82,23.5 84.7,20.8 87.5,20.8 90.7,20.8 91.5,20 91.5,8.04 U$1.2
LED7
  Top 0.254: R8.2 84.08,30.09 83,29 83,23.5 84.8,21.7 90.8,21.7 92.2,20.3 92.2,10.34 U$1.3
LED_G
  Top 0.254: U3.18 91.42,29.55 88.99,29.55 88.62,29.18 85.79,29.18 85.03,28.42 D1.A
LED_O  (via drill 0.35)
  Top 0.254: v95.03,25.25 95.58,25.81 95.58,27.39 U3.25
  Top 0.305: v93.23,25 93,25.24 D2.A
  Bottom 0.254: v93.23,25 94.68,25 94.77,25.1 94.87,25.1 v95.03,25.25
N$1
  Top 0.406: Q5.1 23,30.45 23,29 21.5,27.5 D17.A
N$2
  Top 0.305: R12.1 85.05,26.57 D1.C
N$3
  Top 0.406: R22.2 D12.C D17.C
N$4
  Top 0.254: D3.C D13.C 105.85,12.5 R14.2
N$5
  Top 0.254: D4.C 102,20.5 104,18.5 107,18.5 108.5,17 108.5,15.05 Q2.2
N$6
  Top 0.406: Q5.2 21.1,29.55 20.83,29.82 D11.C
N$7
  Top 0.254: R13.2 109,14.4 Q2.3
N$8
  Top 0.406: Q5.3 23.65,30.95 R21.2
N$9
  Top 0.254: R16.2 80.65,19 D6.C D14.C
N$10
  Top 0.254: Q1.2 77.95,14.5 78,14.5 78,20 77,21 D5.C
N$11
  Top 0.254: R15.2 80.65,14.5 Q1.3
N$12
  Top 0.152: R1.1 86.93,41.64 87.96,40.61 90.97,40.61 91.53,41.17 U1.18
N$13
  Top 0.152: R2.1 86.97,40.19 91.11,40.19 92.14,41.22 92.14,42.36 U1.17
N$14
  Top 0.152: R3.1 88.21,39.79 91.18,39.79 92.83,41.43 U1.16
N$15
  Top 0.152: R4.1 89.51,39.43 91.32,39.43 93.48,41.59 U1.15
N$16
  Top 0.152: R5.1 87.56,35.84 87.56,37.03 89.56,39.03 91.42,39.03 94.13,41.73 U1.14
N$17
  Top 0.152: R6.1 87.87,34.49 87.87,36.85 89.61,38.59 91.52,38.59 94.78,41.85 U1.13
N$18
  Top 0.152: R7.1 88.17,33.15 88.17,36.7 89.61,38.14 91.59,38.14 95.43,41.98 U1.12
N$19
  Top 0.152: R8.1 88.48,31.8 88.48,36.58 89.63,37.73 91.73,37.73 96.08,42.08 U1.11
N$20
  Top 0.406: D11.A 20,32.75 R23.1 21.75,34.5 26.5,34.5 27,34 U$11.C
N$21
  Top 0.305: D2.C 90.6,25.47 R10.1
N$22
  Top 0.254: R18.2 55.65,19 D8.C D15.C
N$23
  Top 0.254: Q3.2 52.95,14.5 53,14.5 53,18.5 50.5,21 D7.C
N$24
  Top 0.254: R17.2 55.65,14.5 Q3.3
N$25
  Top 0.254: Q2.1 106.45,17 104.5,17 103.5,16 103.5,14.5 103,14 D13.A
N$26
  Top 0.254: R20.2 29.7,19.35 D10.C D16.C
N$27
  Top 0.254: Q4.2 28,14.55 28,19.5 26.5,21 D9.C
N$28
  Top 0.254: R19.2 30.65,14.5 Q4.3
N$29
  Top 0.254: D14.A 77,15.65 Q1.1
N$30
  Top 0.254: D15.A 52,15.65 Q3.1
N$31
  Top 0.254: D16.A 27,15.65 Q4.1
NRST  (via drill 0.35)
  Top 0.254: U3.4 96.94,32.95 v97.45,32.95
  Bottom 0.254: TP5.TP 97.6,26.84 99.88,29.12 99.88,31.23 98.16,32.95 v97.45,32.95
POWER+  (via drill 0.5)
  Top 0.406: v16.2,37.2 20.7,37.2 21.6,36.3 R23.2
  Top 1.016: J2.2 6,30.5
  Bottom 1.016: J2.2 6,30.5
  other vias: 15.2,37.2 15.2,38.2 15.2,39.2 14.2,39.2 13.2,39.2 12.2,39.2 11.2,39.2 11.2,38.2 11.2,37.2 10.2,37.2
  pour Top (isolate 0.508): 9,31.5 6.59,29.09 arc-45 5.17,28.5 3.5,28.5 arc-90 2.2,29.8 2.2,31 arc-90 4,32.8 4.91,32.8 arc45 6.09,33.29 7.2,34.4 arc45 8,36.33 8,37 arc-90 10,40 15.93,40 arc-90 18,36.9 18,31.5
  pour Bottom (isolate 0.508, rank 5): 18,37 arc-90 17,36 14.33,36 arc45 12.91,35.41 6.59,29.09 arc-45 5.17,28.5 3.5,28.5 arc-90 2.2,29.8 2.2,31 arc-90 4,32.8 4.81,32.8 arc45 6.16,33.36 7.2,34.4 arc45 8,36.33 8,37 arc-90 10,40 16,40 arc-90
RX
  Top 0.254: U3.27 96.54,27.84 96.54,26.83 98.66,24.71 R9.2 98.24,24.02 95.31,24.02 92.67,26.66 92.14,26.66 91.73,27.06 91.73,29.16 U3.19
SWCLK  (via drill 0.35)
  Top 0.254: U3.24 93.33,27.22 93.33,26.83 93.76,26.4 v94.45,26.4
  Bottom 0.152: v94.45,26.4 94.55,26.4 94.96,26.81 TP1.TP
SWDIO  (via drill 0.35)
  Top 0.254: U3.23 92.85,27.44 v92.52,27.44
  Bottom 0.152: v92.52,27.44 TP2.TP
VIN  (via drill 0.5)
  Top 0.406: D12.A 16.8,25.5 U$10.B1
  Top 1.016: v15.2,23.3 15.4,23.5 29.3,23.5 30.78,24.98 30.78,26.5 | J1.1 36.48,37.7 30.78,32 30.78,26.5 | J6.2 42.24,43.24 38.28,39.28 J1.1 | 38.48,37.5 J1.1 | C6.1 30.78,26.5
  other vias: 11.2,24.3 10.2,24.3 11.2,23.3 11.2,22.3 12.2,22.3 13.2,22.3 14.2,22.3 15.2,22.3 15.2,24.3 16.2,24.3 10.6,18.2 9.6,17.2 8.6,16.2 8.6,15.2 8.6,14.2 9.6,13.2 10.6,12.2 35.3,18.2 34.3,17.2 33.3,16.2 33.3,15.2 33.3,14.2 34.3,13.2 35.3,12.2 60.3,18.2 59.3,17.2 58.3,16.2 58.3,15.2 58.3,14.2 59.3,13.2 60.3,12.2 85.3,18.2 84.3,17.2 83.3,16.2 83.3,15.2 83.3,14.2 84.3,13.2 85.3,12.2
  pour Bottom (isolate 0.508): 86.5,19.5 86.5,11 8.5,11 8.5,24 10,25.5 18,25.5 18,19.5
  pour Top (isolate 0.508, rank 3): 8.5,11 8.5,27.5 10.5,29.5 18,29.5 18,21.5 16.5,20 16.5,11
  pour Top (isolate 0.254): 41,19.5 41,11 32.5,11 32.5,19.5
  pour Top (isolate 0.254): 66,19.5 66,11 57.5,11 57.5,19.5
  pour Top (isolate 0.254): 91,19.5 91,11 82.5,11 82.5,19.5
VOUT1
  Top 0.254: U$4.B2 99.1,16 D3.A
  pour Top (isolate 0.508, rank 4): 92.5,19.5 101,19.5 101,11.5 104,11.5 104,6 arc-90 102,4 99.5,4 arc-90 97.5,6 97.5,8.5 92.5,8.5
VOUT2
  Top 0.254: U$7.B1 72.2,19 D6.A
  pour Top (isolate 0.508, rank 4): 67.5,20 74.5,20 74.5,15.5 75.5,15.5 75.5,11.5 79,11.5 79,6 arc-90 77,4 74.5,4 arc-90 72.5,6 72.5,8.5 67.5,8.5
VOUT3
  Top 0.254: U$8.B1 47.2,19 D8.A
  pour Top (isolate 0.508, rank 4): 42.5,20 49.5,20 49.5,15.5 50.5,15.5 50.5,11.5 54,11.5 54,6 arc-90 52,4 49.5,4 arc-90 47.5,6 47.5,8.5 42.5,8.5
VOUT4
  Top 0.254: U$9.B1 22.2,19 D10.A
  pour Top (isolate 0.508, rank 4): 17.5,20 24.5,20 24.5,15.5 25.5,15.5 25.5,11.5 29,11.5 29,6 arc-90 27,4 24.5,4 arc-90 22.5,6 22.5,8.5 17.5,8.5

### Text on the board
tPlace: G D0 D1 V+ | G D2 D3 V+ | G D4 D5 V+ | G D6 D7 V+
_tNames: GND | VIN | Input | electromage.com / Output Expander Pro Mini / v3.1 ©2021 / Ben Hencke | VIN | GND | 5V | 5V | 5V | CLK | VIN to 5V / Converter | Draw | DAT | 1 | 2 | 4 | Set Addr | Status | GND | VIN
_bNames: Input | electromage.com / Output Expander Pro Mini / v3.1 ©2021 / Ben Hencke | 5V | CLK | DAT | 3V | G | D | C | R | Programming Pins | GND